# EAGLE schematic TracKat  Module - Weight (EAGLE 9.6.2)
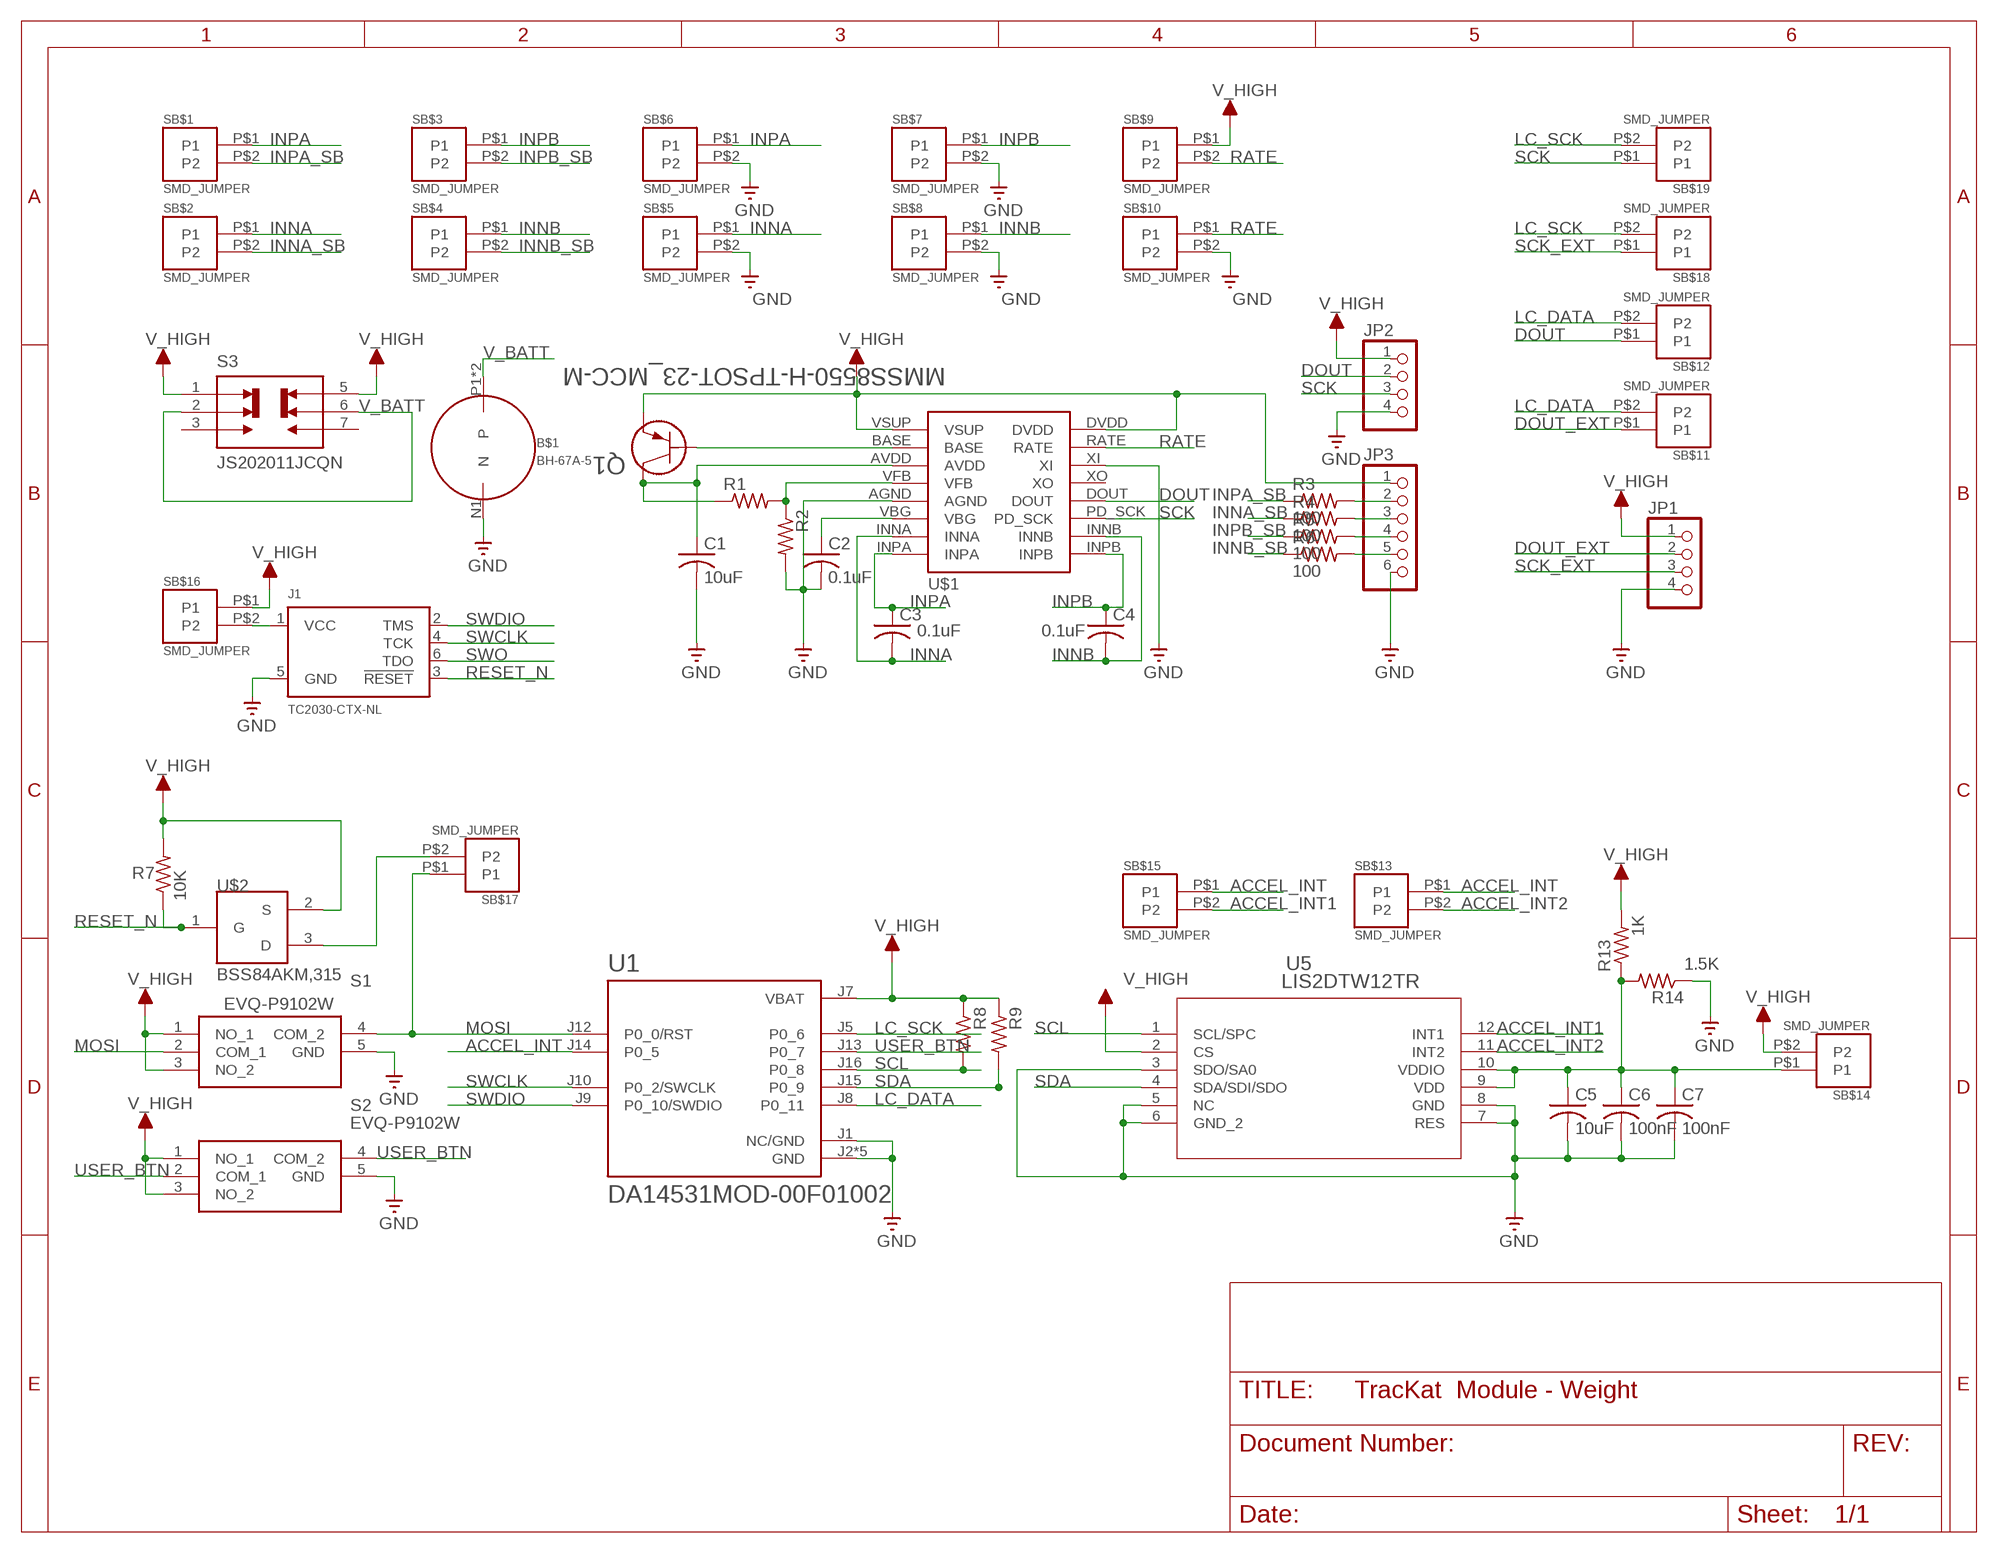
[diagram p0: schematic, sheet 1]

## Parts
B$1  BH-67A-5  [BH-67A-5]
C1  10uF  C-USC0603  [C0603]
C2  0.1uF  C-USC0603  [C0603]
C3  0.1uF  C-USC0603  [C0603]
C4  0.1uF  C-USC0603  [C0603]
C5  10uF  C-USC0603  [C0603]
C6  100nF  C-USC0603  [C0603]
C7  100nF  C-USC0603  [C0603]
J1  TC2030-CTX-NL  [TC2030-IDC-NL]
JP1  PINHD-1X4  [1X04]
JP2  PINHD-1X4  [1X04]
JP3  PINHD-1X6  [1X06]
Q1  MMSS8550-H-TPSOT-23_MCC-M  [SOT-23_MCC-M]
R1  R-US_R0603  [R0603]
R2  R-US_R0603  [R0603]
R3  100  R-US_R0603  [R0603]
R4  100  R-US_R0603  [R0603]
R5  100  R-US_R0603  [R0603]
R6  100  R-US_R0603  [R0603]
R7  10K  R-US_R0603  [R0603]
R8  R-US_R0603  [R0603]
R9  R-US_R0603  [R0603]
R13  1K  R-US_R0603  [R0603]
R14  1.5K  R-US_R0603  [R0603]
S1  EVQ-P9102W  [EVQP9102W]
S2  EVQ-P9102W  [EVQP9102W]
S3  JS202011JCQN  [SW_JS202011JCQN]
SB$1  SMD_JUMPER  [SMD_JUMPER]
SB$2  SMD_JUMPER  [SMD_JUMPER]
SB$3  SMD_JUMPER  [SMD_JUMPER]
SB$4  SMD_JUMPER  [SMD_JUMPER]
SB$5  SMD_JUMPER  [SMD_JUMPER]
SB$6  SMD_JUMPER  [SMD_JUMPER]
SB$7  SMD_JUMPER  [SMD_JUMPER]
SB$8  SMD_JUMPER  [SMD_JUMPER]
SB$9  SMD_JUMPER  [SMD_JUMPER]
SB$10  SMD_JUMPER  [SMD_JUMPER]
SB$11  SMD_JUMPER  [SMD_JUMPER]
SB$12  SMD_JUMPER  [SMD_JUMPER]
SB$13  SMD_JUMPER  [SMD_JUMPER]
SB$14  SMD_JUMPER  [SMD_JUMPER]
SB$15  SMD_JUMPER  [SMD_JUMPER]
SB$16  SMD_JUMPER  [SMD_JUMPER]
SB$17  SMD_JUMPER  [SMD_JUMPER]
SB$18  SMD_JUMPER  [SMD_JUMPER]
SB$19  SMD_JUMPER  [SMD_JUMPER]
U1  DA14531MOD-00F01002  [XCVR_DA14531MOD-00F01002]
U5  LIS2DTW12TR  [LGA_DTW12_STM]
U$1  HX711  [HX711]
U$2  BSS84AKM,315  [DFN985X585X50-3N]

## Nets
ACCEL_INT: SB$13.P$1(P1) SB$15.P$1(P1) U1.J14(P0_5)
ACCEL_INT1: SB$15.P$2(P2) U5.12(INT1)
ACCEL_INT2: SB$13.P$2(P2) U5.11(INT2)
DOUT: JP2.2 SB$12.P$1(P1) U$1.DOUT
DOUT_EXT: JP1.2 SB$11.P$1(P1)
GND: B$1.N1(N) C1.2 C2.2 C5.2 C6.2 C7.2 J1.5(GND) JP1.4 JP2.4 JP3.6 R2.2 R14.1 S1.5(GND) S2.5(GND) SB$5.P$2(P2) SB$6.P$2(P2) SB$7.P$2(P2) SB$8.P$2(P2) SB$10.P$2(P2) U1.J1(NC/GND) U1.J2(GND) U1.J3(GND) U1.J4(GND) U1.J6(GND) U1.J11(GND) U5.3(SDO/SA0) U5.5(NC) U5.6(GND_2) U5.7(RES) U5.8(GND) U$1.AGND U$1.XI
INNA: C3.2 SB$2.P$1(P1) SB$5.P$1(P1) U$1.INNA
INNA_SB: R4.1 SB$2.P$2(P2)
INNB: C4.2 SB$4.P$1(P1) SB$8.P$1(P1) U$1.INNB
INNB_SB: R6.1 SB$4.P$2(P2)
INPA: C3.1 SB$1.P$1(P1) SB$6.P$1(P1) U$1.INPA
INPA_SB: R3.1 SB$1.P$2(P2)
INPB: C4.1 SB$3.P$1(P1) SB$7.P$1(P1) U$1.INPB
INPB_SB: R5.1 SB$3.P$2(P2)
LC_DATA: SB$11.P$2(P2) SB$12.P$2(P2) U1.J8(P0_11)
LC_SCK: SB$18.P$2(P2) SB$19.P$2(P2) U1.J5(P0_6)
MOSI: S1.2(COM_1) S1.4(COM_2) SB$17.P$1(P1) U1.J12(P0_0/RST)
N$1: R1.2 R2.1 U$1.VFB
N$2: Q1.1 U$1.BASE
N$5: C1.1 Q1.3 R1.1 U$1.AVDD
N$7: C2.1 U$1.VBG
N$9: JP3.5 R6.2
N$10: JP3.4 R5.2
N$11: JP3.3 R4.2
N$12: JP3.2 R3.2
N$17: C5.1 C6.1 C7.1 R13.1 R14.2 SB$14.P$1(P1) U5.9(VDD) U5.10(VDDIO)
N$19: J1.1(VCC) SB$16.P$2(P2)
N$21: SB$17.P$2(P2) U$2.3(D)
RATE: SB$9.P$2(P2) SB$10.P$1(P1) U$1.RATE
RESET_N: J1.3(!RESET) R7.1 U$2.1(G)
SCK: JP2.3 SB$19.P$1(P1) U$1.PD_SCK
SCK_EXT: JP1.3 SB$18.P$1(P1)
SCL: R8.2 U1.J16(P0_8) U5.1(SCL/SPC)
SDA: R9.2 U1.J15(P0_9) U5.4(SDA/SDI/SDO)
SWCLK: J1.4(TCK) U1.J10(P0_2/SWCLK)
SWDIO: J1.2(TMS) U1.J9(P0_10/SWDIO)
SWO: J1.6(TDO)
USER_BTN: S2.2(COM_1) S2.4(COM_2) U1.J13(P0_7)
V_BATT: B$1.P1(P) B$1.P2(P) S3.2 S3.6
V_HIGH: JP1.1 JP2.1 JP3.1 Q1.2 R7.2 R8.1 R9.1 R13.2 S1.1(NO_1) S1.3(NO_2) S2.1(NO_1) S2.3(NO_2) S3.1 S3.5 SB$9.P$1(P1) SB$14.P$2(P2) SB$16.P$1(P1) U1.J7(VBAT) U5.2(CS) U$1.DVDD U$1.VSUP U$2.2(S)
Unconnected: S3.3 S3.7 U$1.XO

## Library data of the parts
B$1 = Coin Cell Clips:BH-67A-5
C1-C7 = rcl:C-US: CAPACITOR, American symbol; SPICEPREFIX: C
J1 = TC2030-CTX:TC2030-CTX: Tag Connect footprint for ARM JTAG. 10 pin ARM Cortex Debug Connector. Check prices <https://pricing.snapeda.com/parts/TC2030-CTX/Tag-Connect%20LLC/view-part?ref=eda>; AVAILABILITY: In Stock; DESCRIPTION: Cortex® Plug-Of-Nails™ Adapter Cable; MF: Tag-Connect LLC; MP: TC2030-CTX; PACKAGE: None; PRICE: None; PURCHASE-URL: https://pricing.snapeda.com/search/part/TC2030-CTX/?ref=eda
JP1 JP2 = pinhead:PINHD-1X4: PIN HEADER
JP3 = pinhead:PINHD-1X6: PIN HEADER
Q1 = MMSS8550-H-TP:MMSS8550-H-TP; COPYRIGHT: Copyright (C) 2021 Ultra Librarian. All rights reserved.; DIGI-KEY_PART_NUMBER_1: MMSS8550-H-TPMSTR-ND; DIGI-KEY_PART_NUMBER_2: MMSS8550-H-TPMSCT-ND; DIGI-KEY_PART_NUMBER_3: MMSS8550-H-TPMSDKR-ND; MANUFACTURER_PART_NUMBER: MMSS8550-H-TP; MFR_NAME: MCC
R1-R9 R13 R14 = rcl:R-US_: RESISTOR, American symbol; SPICEPREFIX: R
S1 S2 = EVQ-P9102W:EVQ-P9102W: Tactile Switches 4.7x3.52.5mm 4N With Grnd Term Source: Datasheet <https://industrial.panasonic.com/cdbs/www-data/pdf/ATK0000/ATK0000C374.pdf>; ARROW_PART_NUMBER: EVQ-P9102W; ARROW_PRICE-STOCK: https://www.arrow.com/en/products/evq-p9102w/panasonic; DESCRIPTION: Tactile Switches 4.7x3.52.5mm 4N With Grnd Term; HEIGHT: 2.5mm; MANUFACTURER_NAME: Panasonic; MANUFACTURER_PART_NUMBER: EVQ-P9102W; MOUSER_PART_NUMBER: 667-EVQ-P9102W; MOUSER_PRICE-STOCK: https://www.mouser.co.uk/ProductDetail/Panasonic/EVQ-P9102W?qs=PzGy0jfpSMvUc6TfsFZ%2Fsg%3D%3D
S3 = JS202011JCQN:JS202011JCQN: Slide Switch DPDT Surface Mount; DESCRIPTION: Slide Switch DPDT Surface Mount; DIGI-KEY_PART_NUMBER: CKN10723CT-ND; MF: C&K; MP: JS202011JCQN; PACKAGE: DPDT-6 C&amp;K; PURCHASE-URL: https://pricing.snapeda.com/search/part/JS202011JCQN/?ref=eda
SB$1-SB$19 = Solder_Jumpers:SMD_JUMPER
U1 = DA14531MOD-00F01002:DA14531MOD-00F01002: Dialog Bluetooth Low Energy module; DESCRIPTION: Bluetooth Bluetooth v5.1 Transceiver Module 2.4GHz ~ 2.4835GHz Integrated, Trace Surface Mount; DIGI-KEY_PART_NUMBER: 1695-DA14531MOD-00F01002CT-ND; MF: Dialog Semiconductor GmbH; MP: DA14531MOD-00F01002; PACKAGE: SMD-16 Dialog Semiconductor; PURCHASE-URL: https://pricing.snapeda.com/search/part/DA14531MOD-00F01002/?ref=eda
U5 = Accelerometers:LIS2DTW12TR; COPYRIGHT: Copyright (C) 2021 Ultra Librarian. All rights reserved.; DIGI-KEY_PART_NUMBER_1: 497-19047-2-ND; DIGI-KEY_PART_NUMBER_2: 497-19047-1-ND; DIGI-KEY_PART_NUMBER_3: 497-19047-6-ND; MANUFACTURER_PART_NUMBER: LIS2DTW12TR; MFR_NAME: STMicroelectronics
U$1 = HX711:HX711
U$2 = DFN985X585X50-3N:BSS84AKM,315